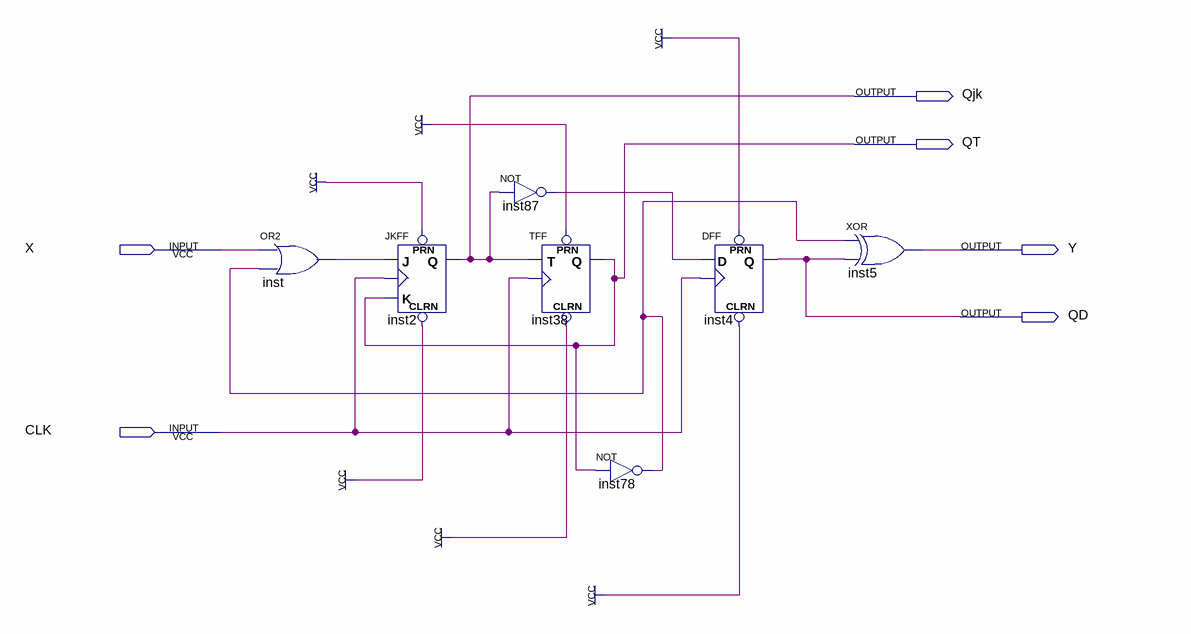
[diagram p0: schematic sheet]
// Quartus schematic FlipFlop.bdf as structural Verilog: 7 symbols, 6 pins
module FlipFlop (
  input  X,
  input  CLK,
  output Qjk,
  output QT,
  output Y,
  output QD
);

  wire inst78_out, inst87_out, inst_out;

  or inst (inst_out, X, inst78_out);
  JKFF inst2 (.PRN(1'b1), .CLRN(1'b1), .K(QT), .J(inst_out), .CLK(CLK), .Q(Qjk));
  not inst87 (inst87_out, Qjk);
  TFF inst38 (.PRN(1'b1), .CLRN(1'b1), .T(Qjk), .CLK(CLK), .Q(QT));
  not inst78 (inst78_out, QT);
  DFF inst4 (.CLRN(1'b1), .CLK(CLK), .D(inst87_out), .PRN(1'b1), .Q(QD));
  xor inst5 (Y, inst78_out, QD);
endmodule
